# Altium project PCB_Robot_Sumo_2024.PrjPcb (part 2 of 2)
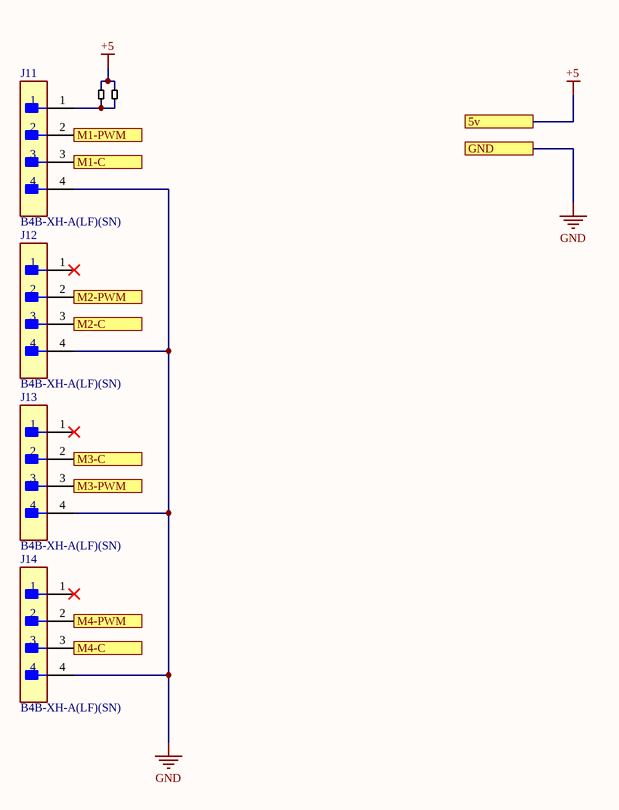
[diagram p6: Drivers.SchDoc]

## Nets that join several sheets
3.3V: Hoja_principal_Sumo_2024 (14 pins), I2C (W18.2 W19.2 W20.2), QTR (8 pins), SPI (5 pins)
+5: Hoja_principal_Sumo_2024 (26 pins), I2C (9 pins), SPI (W24.2 W25.2), UART (J10#2.4 J11#2.4 P6.1 R33.2), Drivers (W30.2 W31.2)
GND: Hoja_principal_Sumo_2024 (38 pins), I2C (18 pins), QTR (8 pins), SPI (14 pins), UART (D20#2.1 J10#2.1 J11#2.1 P6.4), Drivers (J11#3.4 J12#2.4 J13#2.4 J14#2.4)
4: Hoja_principal_Sumo_2024 (U1.4), QTR (P16.3)
5: Hoja_principal_Sumo_2024 (U1.5), QTR (P17.3)
17: Hoja_principal_Sumo_2024 (U1.17), Drivers (J11#3.2)
18: Hoja_principal_Sumo_2024 (U1.18), Drivers (J11#3.3)
23: Hoja_principal_Sumo_2024 (U1.23), Drivers (J12#2.3)
24: Hoja_principal_Sumo_2024 (U1.24), Drivers (J12#2.2)
25: Hoja_principal_Sumo_2024 (U1.25), Drivers (J13#2.3)
26: Hoja_principal_Sumo_2024 (U1.26), Drivers (J13#2.2)
31: Hoja_principal_Sumo_2024 (U1.31), Drivers (J14#2.2)
32: Hoja_principal_Sumo_2024 (U1.32), Drivers (J14#2.3)
38: Hoja_principal_Sumo_2024 (U1.38), QTR (P18.3)
39: Hoja_principal_Sumo_2024 (U1.39), QTR (P19.3)
L1: Hoja_principal_Sumo_2024 (U2.4), I2C (J13#1.5 R16.2)
L2: Hoja_principal_Sumo_2024 (U2.5), I2C (J14#1.5 R17.2)
L3: Hoja_principal_Sumo_2024 (U2.6), I2C (J15.5 R18.2)
L4: Hoja_principal_Sumo_2024 (U2.7), I2C (J16.5 R19.2)
L5: Hoja_principal_Sumo_2024 (U2.9), I2C (J17.5 R20.2)
L6: Hoja_principal_Sumo_2024 (U2.10), I2C (J18.5 R21.2)
L.S.28: Hoja_principal_Sumo_2024 (5 pins), I2C (9 pins)
L.S.29: Hoja_principal_Sumo_2024 (5 pins), I2C (9 pins)
L.S.30: Hoja_principal_Sumo_2024 (U5.7), SPI (R25.1)
L.S.MISO: Hoja_principal_Sumo_2024 (U5.4), SPI (J19.2 J20.2 U9.11)
L.S.MOSI: Hoja_principal_Sumo_2024 (U5.5), SPI (J19.3 J20.3 R23.1)
L.S.RXD0: Hoja_principal_Sumo_2024 (U5.3), UART (J10#2.3 J11#2.3 P6.2)
L.S.SCK: Hoja_principal_Sumo_2024 (U5.6), SPI (J19.4 J20.4 R24.1)
L.S.TXD0: Hoja_principal_Sumo_2024 (U5.1), UART (J10#2.2 J11#2.2 P6.3)
PO6: Hoja_principal_Sumo_2024 (U2.11), SPI (J20.5)
PO7: Hoja_principal_Sumo_2024 (U2.12), SPI (J19.5)